# Altium schematic sheet Power Supplies.SchDoc: RB25DET - Power Supplies
size A4; Address1: Drawn By:; Address2: Dan Visser; DocumentNumber: A; Revision: 0.1; SheetNumber: 2; SheetTotal: 12; PageSetup: Record=PageOptions|CenterHorizontal=True|CenterVertical=True|PrintScale=0.97|XCorrection=1.00|YCorrection=1.00|PrintKind=1|BorderSize=5000000|LeftOffset=0|BottomOffset=0|Orientation=2|PaperLength=1000|PaperWidth=1000|Scale=100|PaperSource=1274|PrintQuality=600|MediaType=1|DitherType=10|PaperKind=A4|PrintScaleMode=1
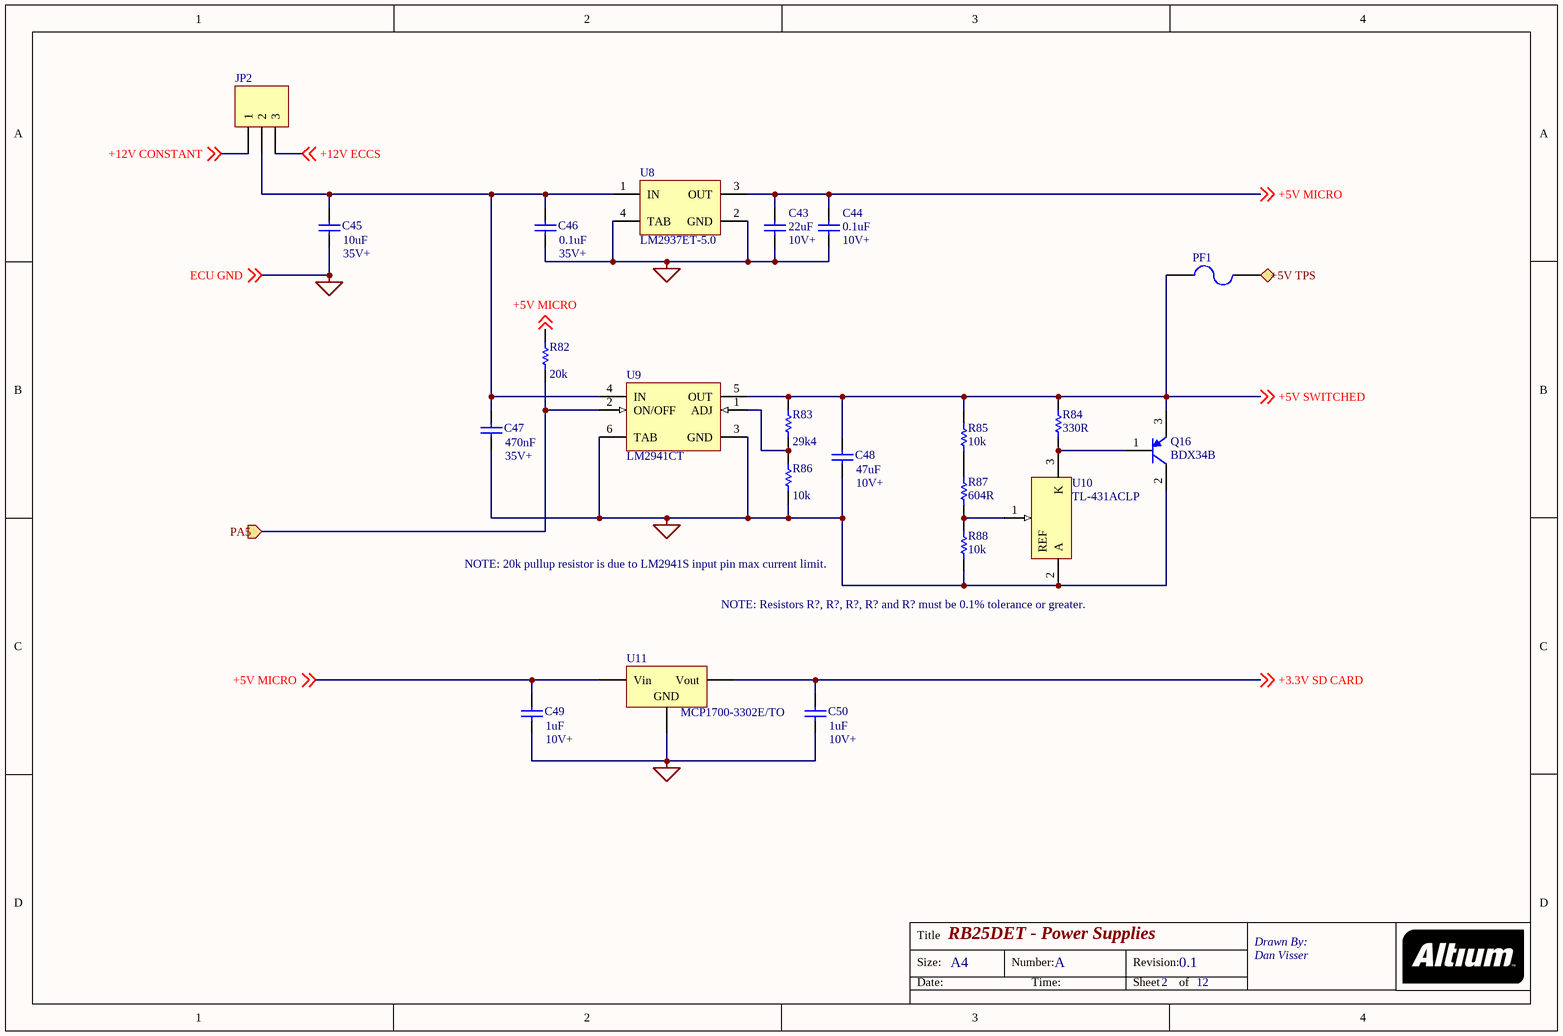
[diagram p0: Power Supplies.SchDoc]

## Parts
C43  value 22uF  [RAD-0.3]
C44  value 0.1uF  [RAD-0.3]
C45  value 10uF  [RAD-0.3]
C46  value 0.1uF  [RAD-0.3]
C47  value 470nF  [RAD-0.3]
C48  value 47uF  [RAD-0.3]
C49  value 1uF  [RAD-0.3]
C50  value 1uF  [RAD-0.3]
JP2  (no value)  [HDR1X3]
PF1  (no value)  [PIN-W2/E2.8]
Q16  BDX34B  [SOT-23B_N]
R82  value 20k  [AXIAL-0.3]
R83  value 29k4  [AXIAL-0.3]
R84  value 330R  [AXIAL-0.3]
R85  value 10k  [AXIAL-0.3]
R86  value 10k  [AXIAL-0.3]
R87  value 604R  [AXIAL-0.3]
R88  value 10k  [AXIAL-0.3]
U8  LM2937ET-5.0  [TS3B_N]
U9  LM2941CT  [TS5B_N]
U10  TL-431ACLP
U11  MCP1700-3302E/TO  [SOT-23-NB3_M]

## Ports
+5V TPS (out), PA5 (in)

## Nets
ECU GND: C43.1 C44.1 C45.1 C46.1 C47.1 C48.1 C49.1 C50.1 Q16.2(C) R86.1 R88.1 U8.2(GND) U8.4(TAB) U9.3(GND) U9.6(TAB) U10.2(A) U11.1 ; off-sheet ECU GND
+3.3V SD CARD: C50.2 U11.3(Vout) ; off-sheet +3.3V SD CARD
+5V MICRO: C43.2 C44.2 C49.2 R82.2 U8.3(OUT) U11.2(Vin) ; off-sheet +5V MICRO
+5V SWITCHED: C48.2 PF1.1 Q16.3(E) R83.2 R84.2 R85.2 U9.5(OUT) ; off-sheet +5V SWITCHED
+5V TPS: PF1.2 ; port +5V TPS
+12V CONSTANT: JP2.1 ; off-sheet +12V CONSTANT
+12V ECCS: JP2.3 ; off-sheet +12V ECCS
PA5: R82.1 U9.2(ON/OFF) ; port PA5
NetC45_2: C45.2 C46.2 C47.2 JP2.2 U8.1(IN) U9.4(IN)
NetQ16_1: Q16.1(B) R84.1 U10.3(K)
NetR83_1: R83.1 R86.2 U9.1(ADJ)
NetR85_1: R85.1 R87.2
NetR87_1: R87.1 R88.2 U10.1(REF)

## Notes on the sheet
- 10V+
- (near C44) 10V+
- (near C45) 35V+
- (near C46) 35V+
- (near C47) 35V+
- (near C48) 10V+
- NOTE: 20k pullup resistor is due to LM2941S input pin max current limit.
- NOTE: Resistors R?, R?, R?, R? and R? must be 0.1% tolerance or greater.
- (near C49) 10V+
- (near C50) 10V+
- Title
- Size:
- Date:
- A4
- Number:
- Time:
- Revision:
- Sheet
- of
- (in symbol Volt Reg) GND

## Library data of the parts
C43-C50 = Cap: Capacitor; Published: 8-Jun-2000; LatestRevisionDate: 17-Jul-2002; LatestRevisionNote: Re-released for DXP Platform.; PackageReference: RAD-0.3; Publisher: Altium Limited; PackageDescription: Radial Cap, Thru-Hole; 2 Leads; 0.3 in Pin Spacing
JP2 = Header 3: Header, 3-Pin; LatestRevisionDate: 17-Jul-2002; LatestRevisionNote: Re-released for DXP Platform.; Publisher: Altium Limited
PF1 = Fuse 2: Fuse; Published: 8-Jun-2000; LatestRevisionDate: 17-Jul-2002; LatestRevisionNote: Re-released for DXP Platform.; PackageReference: PIN-W2/E2.8; Publisher: Altium Limited; PackageDescription: Thru-Hole; 2 Leads
Q16 = PNP: PNP Bipolar Transistor; Published: 8-Jun-2000; LatestRevisionDate: 29-May-2009; LatestRevisionNote: IPC-7351 Footprint Added.; PackageVersion: Aug-1999; PackageReference: SOT-23B; Publisher: Altium Limited; PackageDescription: 3-Pin SOT-23 Package 0.95 mm Pitch, 2.4 mm Lead Span
R82-R88 = Res1: Resistor; Published: 8-Jun-2000; LatestRevisionDate: 17-Jul-2002; LatestRevisionNote: Re-released for DXP Platform.; PackageReference: AXIAL-0.3; Publisher: Altium Limited; PackageDescription: Axial Device, Thru-Hole; 2 Leads; 0.3 in Pin Spacing
U8 = LM2937ES-5.0: 500 mA Low Dropout Regulator, 3-pin TO-263; Manufacturer: National Semiconductor; PackageTopMarking: NSUZXYTTE#*LM2937ES*-5.0; PowerWise: N; CompType: LDO IC; Published: 4-Dec-2008; DatasheetVersion: Aug-2005; PackageVersion: revF, Apr-2005; PackageReference: TS3B; Publisher: Altium Limited; PackageDescription: TO-263, Molded, .400 x .390 x .180in, 3 Lead, .1in Pitch, Surface Mount; PartNumber: LM2937ES-5.0; RoHS: N; PinCount: 3; Code_JEDEC: MO-169-AA; ComponentLink1Description: LM2937 Datasheet; ComponentLink1URL: http://www.national.com/ds/LM/LM2937.pdf; ComponentLink2Description: LM2937 Web Page; ComponentLink2URL: http://www.national.com/pf/LM/LM2937.html; ComponentLink3Description: TS3B Package Page; ComponentLink3URL: http://www.national.com/packaging/folders/ts3b.html
U9 = LM2941S: 1A Low Dropout Adjustable Regulator, 5-pin TO-263; Manufacturer: National Semiconductor; PackageTopMarking: NSUZXYTTE#*LM2941S*P+; PowerWise: N; CompType: LDO IC; Published: 4-Dec-2008; DatasheetVersion: Nov-2007; PackageVersion: revD, Apr-2005; PackageReference: TS5B; Publisher: Altium Limited; PackageDescription: TO-263, Molded, .400 x .390 x .180in, 5 Lead, .067in Pitch, Surface Mount; Supplier 1: Farnell; Supplier Part Number 1: 9494456; PartNumber: LM2941S; RoHS: N; PinCount: 5; Code_JEDEC: MO-169-AB; ComponentLink1Description: LM2941 Datasheet; ComponentLink1URL: http://www.national.com/ds/LM/LM2941.pdf; ComponentLink2Description: LM2941 Web Page; ComponentLink2URL: http://www.national.com/pf/LM/LM2941.html; ComponentLink3Description: TS5B Package Page; ComponentLink3URL: http://www.national.com/packaging/folders/ts5b.html
U10 = PM-REF-431-SIL3
U11 = Volt Reg: Voltage Regulator; Published: 24-Mar-1999; LatestRevisionDate: 29-May-2009; LatestRevisionNote: IPC-7351 Footprint Added.; PackageReference: D2PAK; Publisher: Altium Limited; PackageDescription: 3-Pin Transistor Outline Package 2.54 mm Pitch, 15.1 mm Lead Span